# Altium schematic sheet mcu.SchDoc
size A3; SheetNumber: 1; SheetTotal: 6
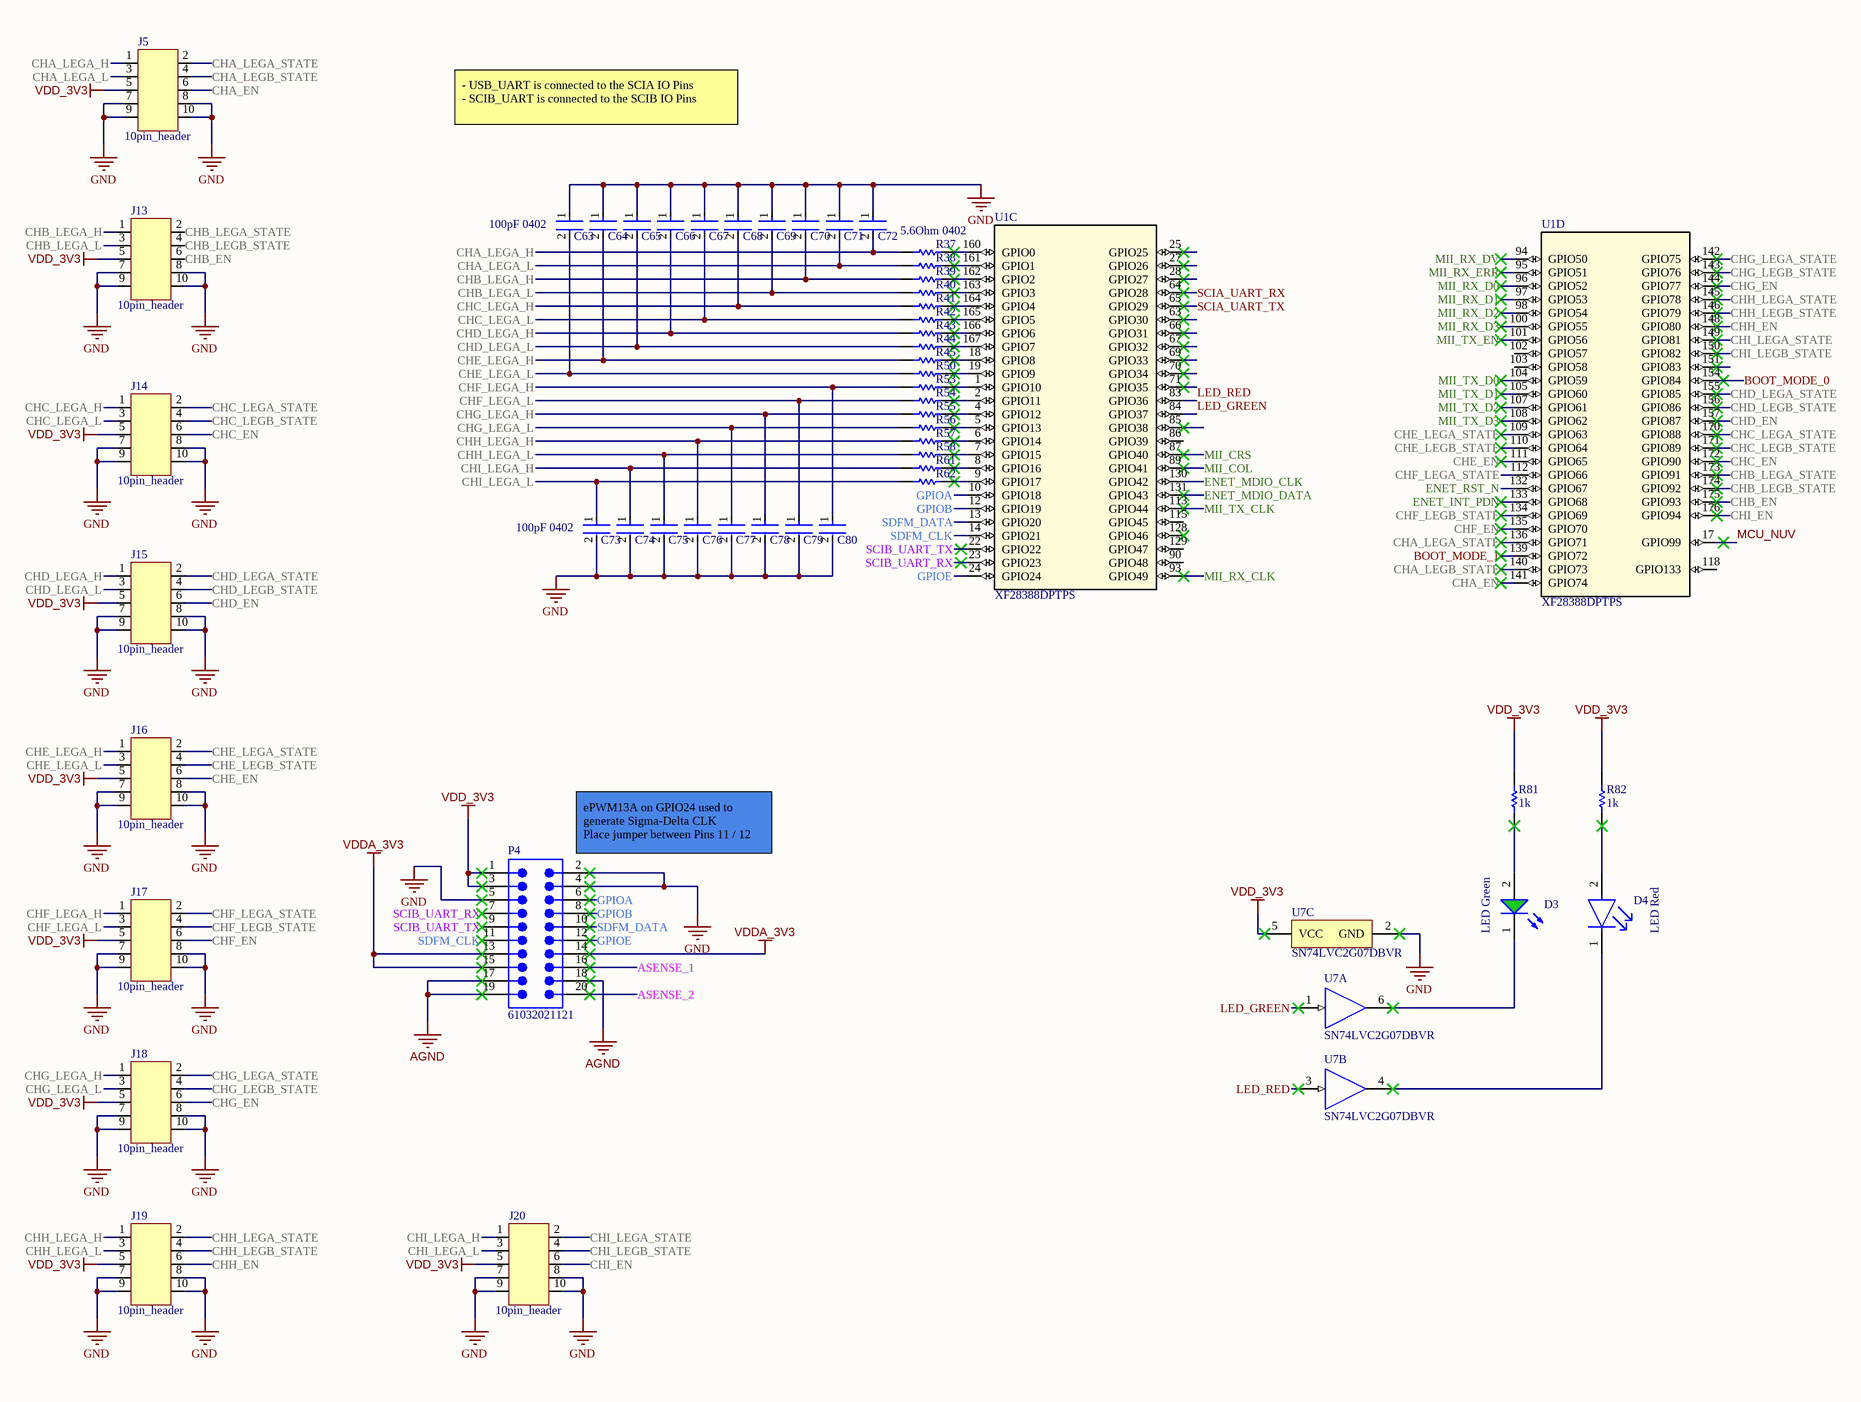
[diagram p0: mcu.SchDoc, right]

## Parts
C63  100pF 0402  [FP-0402-L_1_0_1-W_0_5_0_1-MFG]
C64  100pF 0402  [FP-0402-L_1_0_1-W_0_5_0_1-MFG]  (value not drawn)
C65  100pF 0402  [FP-0402-L_1_0_1-W_0_5_0_1-MFG]  (value not drawn)
C66  100pF 0402  [FP-0402-L_1_0_1-W_0_5_0_1-MFG]  (value not drawn)
C67  100pF 0402  [FP-0402-L_1_0_1-W_0_5_0_1-MFG]  (value not drawn)
C68  100pF 0402  [FP-0402-L_1_0_1-W_0_5_0_1-MFG]  (value not drawn)
C69  100pF 0402  [FP-0402-L_1_0_1-W_0_5_0_1-MFG]  (value not drawn)
C70  100pF 0402  [FP-0402-L_1_0_1-W_0_5_0_1-MFG]  (value not drawn)
C71  100pF 0402  [FP-0402-L_1_0_1-W_0_5_0_1-MFG]  (value not drawn)
C72  100pF 0402  [FP-0402-L_1_0_1-W_0_5_0_1-MFG]  (value not drawn)
C73  100pF 0402  [FP-0402-L_1_0_1-W_0_5_0_1-MFG]
C74  100pF 0402  [FP-0402-L_1_0_1-W_0_5_0_1-MFG]  (value not drawn)
C75  100pF 0402  [FP-0402-L_1_0_1-W_0_5_0_1-MFG]  (value not drawn)
C76  100pF 0402  [FP-0402-L_1_0_1-W_0_5_0_1-MFG]  (value not drawn)
C77  100pF 0402  [FP-0402-L_1_0_1-W_0_5_0_1-MFG]  (value not drawn)
C78  100pF 0402  [FP-0402-L_1_0_1-W_0_5_0_1-MFG]  (value not drawn)
C79  100pF 0402  [FP-0402-L_1_0_1-W_0_5_0_1-MFG]  (value not drawn)
C80  100pF 0402  [FP-0402-L_1_0_1-W_0_5_0_1-MFG]  (value not drawn)
D3  LED Green  [WL-SMCD_0603]
D4  LED Red  [FP-6_541-5092_01-4-MFG]
J5  10pin_header  [header_10]
J13  10pin_header  [header_10]
J14  10pin_header  [header_10]
J15  10pin_header  [header_10]
J16  10pin_header  [header_10]
J17  10pin_header  [header_10]
J18  10pin_header  [header_10]
J19  10pin_header  [header_10]
J20  10pin_header  [header_10]
P4  61032021121  [61032021121]
R37  5.6Ohm 0402  [RESC1005X40X25NL05T10]
R38  5.6Ohm 0402  [RESC1005X40X25NL05T10]  (value not drawn)
R39  5.6Ohm 0402  [RESC1005X40X25NL05T10]  (value not drawn)
R40  5.6Ohm 0402  [RESC1005X40X25NL05T10]  (value not drawn)
R41  5.6Ohm 0402  [RESC1005X40X25NL05T10]  (value not drawn)
R42  5.6Ohm 0402  [RESC1005X40X25NL05T10]  (value not drawn)
R43  5.6Ohm 0402  [RESC1005X40X25NL05T10]  (value not drawn)
R44  5.6Ohm 0402  [RESC1005X40X25NL05T10]  (value not drawn)
R45  5.6Ohm 0402  [RESC1005X40X25NL05T10]  (value not drawn)
R50  5.6Ohm 0402  [RESC1005X40X25NL05T10]  (value not drawn)
R53  5.6Ohm 0402  [RESC1005X40X25NL05T10]  (value not drawn)
R54  5.6Ohm 0402  [RESC1005X40X25NL05T10]  (value not drawn)
R55  5.6Ohm 0402  [RESC1005X40X25NL05T10]  (value not drawn)
R56  5.6Ohm 0402  [RESC1005X40X25NL05T10]  (value not drawn)
R57  5.6Ohm 0402  [RESC1005X40X25NL05T10]  (value not drawn)
R58  5.6Ohm 0402  [RESC1005X40X25NL05T10]  (value not drawn)
R61  5.6Ohm 0402  [RESC1005X40X25NL05T10]  (value not drawn)
R62  5.6Ohm 0402  [RESC1005X40X25NL05T10]  (value not drawn)
R81  1k  [RES 0402_1005]
R82  1k  [RES 0402_1005]
U1  XF28388DPTPS  [PTP0176F-IPC_A]  (parts C,D of 5)
U7  SN74LVC2G07DBVR  [DBV0006A_M]  (parts A,B,C of 3)

## Nets
AGND: P4.17 P4.18 P4.19
GND: C63.1 C64.1 C65.1 C66.1 C67.1 C68.1 C69.1 C70.1 C71.1 C72.1 C73.2 C74.2 C75.2 C76.2 C77.2 C78.2 C79.2 C80.2 J5.7 J5.8 J5.9 J5.10 J13.7 J13.8 J13.9 J13.10 J14.7 J14.8 J14.9 J14.10 J15.7 J15.8 J15.9 J15.10 J16.7 J16.8 J16.9 J16.10 J17.7 J17.8 J17.9 J17.10 J18.7 J18.8 J18.9 J18.10 J19.7 J19.8 J19.9 J19.10 J20.7 J20.8 J20.9 J20.10 P4.2 P4.4 P4.5 U7.2(GND)
VDD_3V3: J5.5 J13.5 J14.5 J15.5 J16.5 J17.5 J18.5 J19.5 J20.5 P4.1 P4.3 R81.1 R82.1 U7.5(VCC)
VDDA_3V3: P4.13 P4.14 P4.15
ASENSE_1: P4.16
ASENSE_2: P4.20
BOOT_MODE_0: U1.154(GPIO84)
BOOT_MODE_1: U1.139(GPIO72)
CHA_EN: J5.6 U1.141(GPIO74)
CHA_LEGA_H: C72.2 J5.1 R37.1
CHA_LEGA_L: C71.2 J5.3 R38.1
CHA_LEGA_STATE: J5.2 U1.136(GPIO71)
CHA_LEGB_STATE: J5.4 U1.140(GPIO73)
CHB_EN: J13.6 U1.175(GPIO93)
CHB_LEGA_H: C70.2 J13.1 R39.1
CHB_LEGA_L: C69.2 J13.3 R40.1
CHB_LEGA_STATE: J13.2 U1.173(GPIO91)
CHB_LEGB_STATE: J13.4 U1.174(GPIO92)
CHC_EN: J14.6 U1.172(GPIO90)
CHC_LEGA_H: C68.2 J14.1 R41.1
CHC_LEGA_L: C67.2 J14.3 R42.1
CHC_LEGA_STATE: J14.2 U1.170(GPIO88)
CHC_LEGB_STATE: J14.4 U1.171(GPIO89)
CHD_EN: J15.6 U1.157(GPIO87)
CHD_LEGA_H: C66.2 J15.1 R43.1
CHD_LEGA_L: C65.2 J15.3 R44.1
CHD_LEGA_STATE: J15.2 U1.155(GPIO85)
CHD_LEGB_STATE: J15.4 U1.156(GPIO86)
CHE_EN: J16.6 U1.111(GPIO65)
CHE_LEGA_H: C64.2 J16.1 R45.1
CHE_LEGA_L: C63.2 J16.3 R50.1
CHE_LEGA_STATE: J16.2 U1.109(GPIO63)
CHE_LEGB_STATE: J16.4 U1.110(GPIO64)
CHF_EN: J17.6 U1.135(GPIO70)
CHF_LEGA_H: C80.1 J17.1 R53.1
CHF_LEGA_L: C79.1 J17.3 R54.1
CHF_LEGA_STATE: J17.2 U1.112(GPIO66)
CHF_LEGB_STATE: J17.4 U1.134(GPIO69)
CHG_EN: J18.6 U1.144(GPIO77)
CHG_LEGA_H: C78.1 J18.1 R55.1
CHG_LEGA_L: C77.1 J18.3 R56.1
CHG_LEGA_STATE: J18.2 U1.142(GPIO75)
CHG_LEGB_STATE: J18.4 U1.143(GPIO76)
CHH_EN: J19.6 U1.148(GPIO80)
CHH_LEGA_H: C76.1 J19.1 R57.1
CHH_LEGA_L: C75.1 J19.3 R58.1
CHH_LEGA_STATE: J19.2 U1.145(GPIO78)
CHH_LEGB_STATE: J19.4 U1.146(GPIO79)
CHI_EN: J20.6 U1.176(GPIO94)
CHI_LEGA_H: C74.1 J20.1 R61.1
CHI_LEGA_L: C73.1 J20.3 R62.1
CHI_LEGA_STATE: J20.2 U1.149(GPIO81)
CHI_LEGB_STATE: J20.4 U1.150(GPIO82)
ENET_INT_PDN: U1.133(GPIO68)
ENET_MDIO_CLK: U1.130(GPIO42)
ENET_MDIO_DATA: U1.131(GPIO43)
ENET_RST_N: U1.132(GPIO67)
GPIOA: P4.6 U1.10(GPIO18)
GPIOB: P4.8 U1.12(GPIO19)
GPIOE: P4.12 U1.24(GPIO24)
LED_GREEN: U1.84(GPIO37) U7.1(1A)
LED_RED: U1.83(GPIO36) U7.3(2A)
MCU_NUV: U1.17(GPIO99)
MII_COL: U1.89(GPIO41)
MII_CRS: U1.87(GPIO40)
MII_RX_CLK: U1.93(GPIO49)
MII_RX_D0: U1.96(GPIO52)
MII_RX_D1: U1.97(GPIO53)
MII_RX_D2: U1.98(GPIO54)
MII_RX_D3: U1.100(GPIO55)
MII_RX_DV: U1.94(GPIO50)
MII_RX_ERR: U1.95(GPIO51)
MII_TX_CLK: U1.113(GPIO44)
MII_TX_D0: U1.104(GPIO59)
MII_TX_D1: U1.105(GPIO60)
MII_TX_D2: U1.107(GPIO61)
MII_TX_D3: U1.108(GPIO62)
MII_TX_EN: U1.101(GPIO56)
SCIA_UART_RX: U1.64(GPIO28)
SCIA_UART_TX: U1.65(GPIO29)
SCIB_UART_RX: P4.7 U1.23(GPIO23)
SCIB_UART_TX: P4.9 U1.22(GPIO22)
SDFM_CLK: P4.11 U1.14(GPIO21)
SDFM_DATA: P4.10 U1.13(GPIO20)
NetD3_1: D3.1(K) U7.6(1Y)
NetD3_2: D3.2(A) R81.2
NetD4_1: D4.1(C) U7.4(2Y)
NetD4_2: D4.2(A) R82.2
NetR37_2: R37.2 U1.160(GPIO0)
NetR38_2: R38.2 U1.161(GPIO1)
NetR39_2: R39.2 U1.162(GPIO2)
NetR40_2: R40.2 U1.163(GPIO3)
NetR41_2: R41.2 U1.164(GPIO4)
NetR42_2: R42.2 U1.165(GPIO5)
NetR43_2: R43.2 U1.166(GPIO6)
NetR44_2: R44.2 U1.167(GPIO7)
NetR45_2: R45.2 U1.18(GPIO8)
NetR50_2: R50.2 U1.19(GPIO9)
NetR53_2: R53.2 U1.1(GPIO10)
NetR54_2: R54.2 U1.2(GPIO11)
NetR55_2: R55.2 U1.4(GPIO12)
NetR56_2: R56.2 U1.5(GPIO13)
NetR57_2: R57.2 U1.6(GPIO14)
NetR58_2: R58.2 U1.7(GPIO15)
NetR61_2: R61.2 U1.8(GPIO16)
NetR62_2: R62.2 U1.9(GPIO17)

Not connected (* = marked no-connect by the designer): U1 25(GPIO25)* 27(GPIO26)* 28(GPIO27)* 63(GPIO30)* 66(GPIO31)* 67(GPIO32)* 69(GPIO33)* 70(GPIO34)* 71(GPIO35)* 85(GPIO38)* 86(GPIO39) 90(GPIO48) 102(GPIO57) 103(GPIO58) 115(GPIO45) 118(GPIO133) 128(GPIO46)* 129(GPIO47) 151(GPIO83)*

## Notes on the sheet
- - USB_UART is connected to the SCIA IO Pins
  - SCIB_UART is connected to the SCIB IO Pins
- (near P4) ePWM13A on GPIO24 used to generate Sigma-Delta CLK
  Place jumper between Pins 11 / 12

## Library data of the parts
C63-C80 = b4654b650e69147ec39a6b967a45e02: MLCC 0402 100pF; Voltage: 50V; Tolerance: 5%; Dielectric: C0G; Insulation Resistance: 1GR; Dissipation Factor: 2.5%; Temperature Coefficient: 30ppm/°C; REACH SVHC: No SVHC; Termination: SMD/SMT; Construction: Flat; Contact Plating: Tin; Width: 0.02inch; Series: -; Voltage Rating (DC): 50V; Voltage Rating: 50V; Height: 0.56mm; Max Operating Temperature: 125°C; Length: 1mm; Lead Free: Lead Free; Case/Package: 0402; Min Operating Temperature: -55°C; Depth: 0.5mm; Case Code (Metric): 1005; Thickness: 0.022inch; Radiation Hardening: No; Case Code (Imperial): 0402; Mount: Surface Mount; Capacitance: 100pF; Packaging: Tape and Reel; Package Quantity: 1; RoHS Compliant: Yes
D3 = CMP-03913-90235563-2: 150060GS55040 WL-SMCD SMT Mono-color Chip LED Diffused; Forward Voltage: 3.2V; Forward Current: 60mA; Luminous Intensity: 430mcd; Peak Wavelength: 520nm; Viewing Angle: 140°; Wavelength: 525nm; Max Reverse Voltage (DC): 5V; Max Operating Temperature: 85°C; Length: 1.6mm; Height: 400µm; Packaging: Tape and Reel; NexarPartId: 90235563; Dominant Wavelength: 525nm; Min Operating Temperature: -40°C; RoHS: Compliant; Width: 800µm
D4 = CMP-02520-000012-1: LED RED 0603 SMD; Manufacturer: Vishay; Manufacturer Part Number: VLMS1300-GS08; Forward Voltage: 2V; Reverse Voltage: 5V; Power Dissipation: 75mW; Forward Current: 20mA; Luminous Intensity: 54mcd; Led Orientation: Top View; Peak Emmision Wavelength: 639nm; Viewing Angle: 130°; Wavelength: 631nm; Digikey Description: LED RED 0603 SMD; Height: 1mm; Colour: Red; Ambient Temperature Range High: +85°C; Ambient Temperature Range Low: -35°C; Package: 6.541-5092.01-4; Automotive: No; Temperature Range High: +85°C; Device Class L3: unset; Lead Free: Yes; Temperature Range Low: -35°C; Temperature: -35°C to +85°C; Device Class L2: LEDs; ComponentLink2Description: Datasheet; Octopart: https://octopart.com/vlms1300-gs08-vishay-21709201; Device Class L1: Optoelectronics; RoHS: TRUE; ComponentLink2URL: http://www.vishay.com/docs/82437/vlmo1300.pdf; Mouser Description: Standard LEDs - SMD Super Red Clear Non-Diff; Category: Diode
J5 J13-J20 = 10pin_header: Pin header male 2x5 2.54mm; Supplier 1: Digikey; Supplier Part Number 1: 1175-1754-ND
P4 = Header_Male_2R_20P: Pin header SMD 10x2; NexarPartId: 32855455; Gender: Male; Number of Contacts: 20; Contact Resistance: 20mΩ; Row Spacing: 2.54mm; Operating Supply Voltage: 250V; Current Rating: 3A; Connector Type: Male Pin; Packaging: Tape and Reel; Contact Material: Copper; RoHS: Compliant; Orientation: Vertical; Contact Mating Length: 5.9944mm; REACH SVHC: Unknown; Number of Rows: 2; Number of Pins: 20; Number of Positions: 20; Termination: Solder; Mount: Surface Mount; Lead Pitch: 2.54mm; Contact Plating: Gold; Color: Black; Pitch: 2.54mm
R37-R45 R50 R53-R58 R61 R62 = RES: Resistor 5.6Ohm 0402; Manufacturer: Yageo / Phycomp; Part Number: RC0402FR-075R6L
R81 R82 = Res1: Resistor 1kOhm 0402 1%; Published: 8-Jun-2000; LatestRevisionDate: 17-Jul-2002; LatestRevisionNote: Re-released for DXP Platform.; PackageReference: AXIAL-0.3; Publisher: Altium Limited; PackageDescription: Axial Device, Thru-Hole; 2 Leads; 0.3 in Pin Spacing; Value: 1k; Supplier 1: Mouser; Supplier Part Number 1: 71-CRCW0402-1.0K-E3
U1 = XF28388DPTPS: Mfr_Name: Texas Instruments; TYPE: TYPE; RefDes: RefDes
U7 = CMP-0859-00195-3: Dual Buffer/Driver with Open-Drain Output, DBV0006A, LARGE T&R; Manufacturer: Texas Instruments; Technology Family: LVC; Output Type: CMOS; 3-State Output: No; Output Drive (IOL/IOH)(Max)(mA): 32/-32; Bits(#): 2; Sub-Family: Inverting Buffer/Driver; ICC @ Nom Voltage(Max)(mA): 0.01; F @ Nom Voltage(Max)(Mhz): 150; VCC(Min)(V): 1.65; VCC(Max)(V): 5.5; Voltage(Nom)(V): 1.8,2.5,3.3,5; Input Type: CMOS/TTL; tpd @ Nom Voltage(Max)(ns): 8.6,4.4,3.7,2.9; Rating: Catalog; Logic: True; Generic Part Number: SN74LVC2G07; Operating Temperature Range(C): -40 to 125; Schmitt Trigger: No; PackageReference: DBV0006A; DatasheetVersion: SCES308K